# Altium schematic sheet MCU_144_IOs_Clone.SchDoc: MCU 144 I/Os
size A3; Date: Not used; ApprovedBy: Not used; CheckedBy: Not used; Author: Not used; CompanyName: STMicroelectronics; DrawnBy: Not used; Engineer: Not used; Organization: Not used; Address1: Not used; Address2: Not used; Address3: Not used; Address4: Not used; DocumentNumber: 3; Revision: Not used; SheetNumber: 3; SheetTotal: 9; CurrentTime: Not used; CurrentDate: Not used; Time: Not used; DocumentFullPathAndName: Not used; DocumentName: Not used; ModifiedDate: Not used; ImagePath: Not used; ProjectName: Not used; Application_BuildNumber: Not used
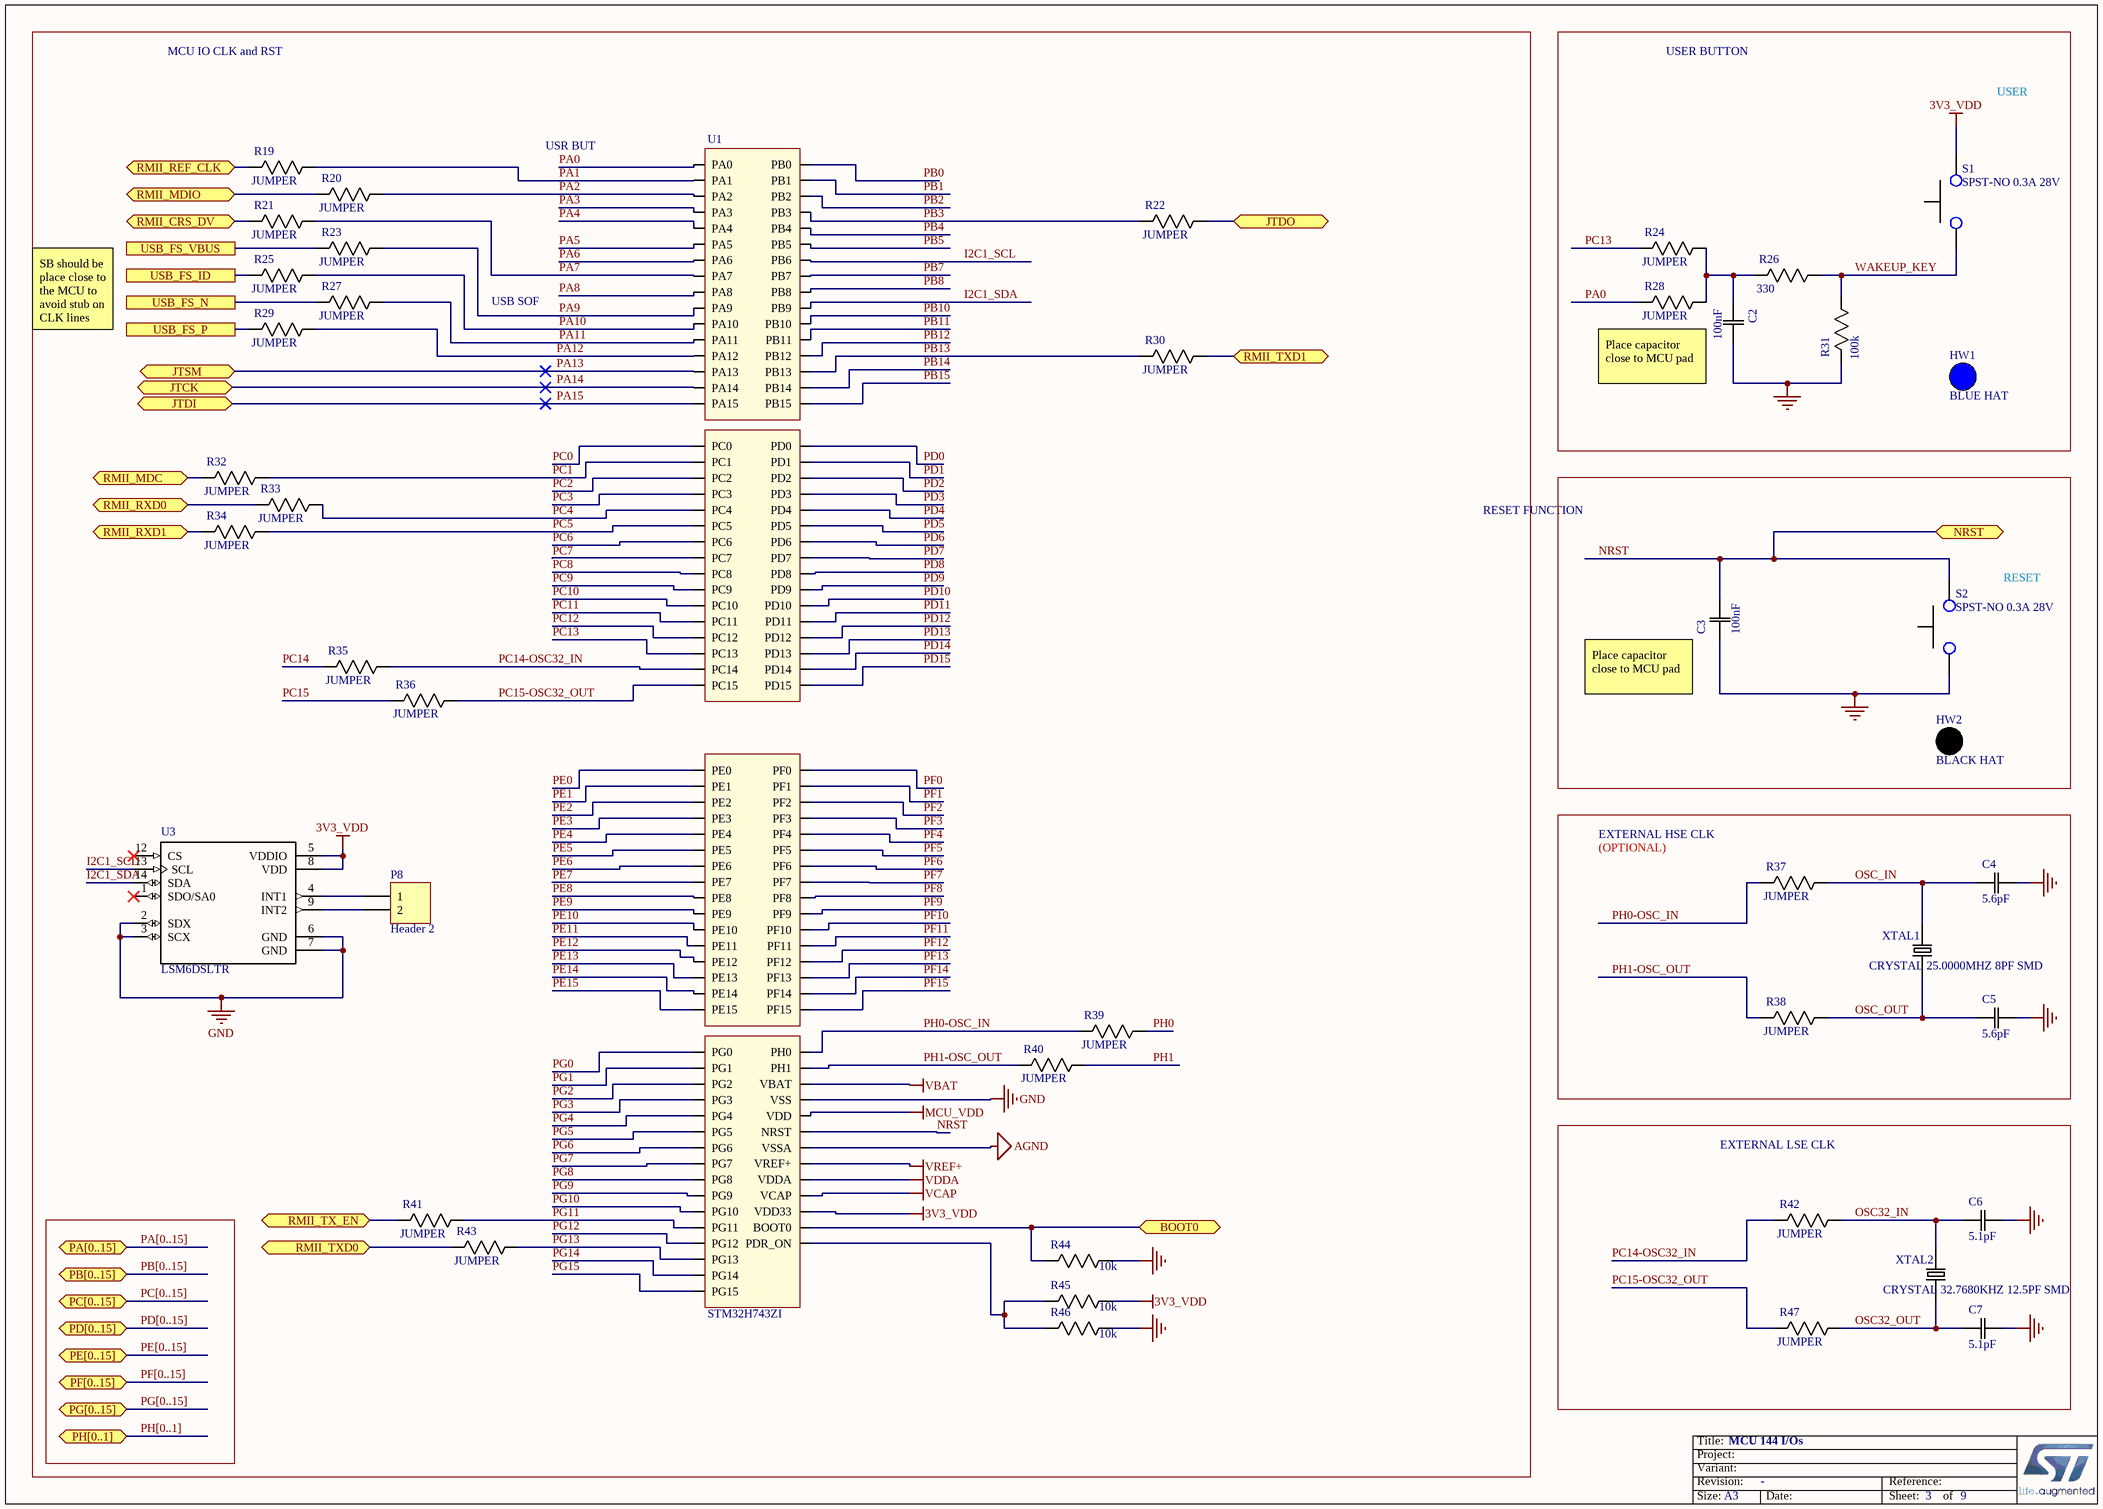
[diagram p0: MCU_144_IOs_Clone.SchDoc]

## Parts
C2  100nF  [0805]
C3  100nF  [0805]
C4  5.6pF  [0805]
C5  5.6pF  [0805]
C6  5.1pF  [0805]
C7  5.1pF  [0805]
HW1  value BLUE HAT  (hidden comment: BUTTON_HAT_BLUE)  (mechanical)
HW2  value BLACK HAT  (hidden comment: BUTTON_HAT_BLACK)  (mechanical)
P8  Header 2  [HDR1X2]
R19  JUMPER  [0805]
R20  JUMPER  [0805]
R21  JUMPER  [0805]
R22  JUMPER  [0805]
R23  JUMPER  [0805]
R24  JUMPER  [0805]
R25  JUMPER  [0805]
R26  330  [0805]
R27  JUMPER  [0805]
R28  JUMPER  [0805]
R29  JUMPER  [0805]
R30  JUMPER  [0805]
R31  100k  [0805]
R32  JUMPER  [0805]
R33  JUMPER  [0805]
R34  JUMPER  [0805]
R35  JUMPER  [0805]
R36  JUMPER  [0805]
R37  JUMPER  [0805]
R38  JUMPER  [0805]
R39  JUMPER  [0805]
R40  JUMPER  [0805]
R41  JUMPER  [0805]
R42  JUMPER  [0805]
R43  JUMPER  [0805]
R44  10k  [0805]
R45  10k  [0805]
R46  10k  [0805]
R47  JUMPER  [0805]
S1  SPST-NO 0.3A 28V  [PB300STQ]
S2  SPST-NO 0.3A 28V  [PB300STQ]
U1  STM32H743ZI  [STM32H7]
U3  LSM6DSLTR  [LGA-14]
XTAL1  CRYSTAL 25.0000MHZ 8PF SMD  [SMD-2]
XTAL2  CRYSTAL 32.7680KHZ 12.5PF SMD  [SMD-2]

## Blocks framed on the sheet
EXTERNAL LSE CLK: C6 C7 R42 R47 XTAL2

## Ports
BOOT0 (bidir), JTCK (bidir), JTDI (bidir), JTDO (bidir), JTSM (bidir), NRST (bidir), PA[0..15] (bidir), PB[0..15] (bidir), PC[0..15] (bidir), PD[0..15] (bidir), PE[0..15] (bidir), PF[0..15] (bidir), PG[0..15] (bidir), PH[0..1] (bidir), RMII_CRS_DV (bidir), RMII_MDC (bidir), RMII_MDIO (bidir), RMII_REF_CLK (bidir), RMII_RXD0 (bidir), RMII_RXD1 (bidir), RMII_TX_EN (bidir), RMII_TXD0 (bidir), RMII_TXD1 (bidir), USB_FS_ID, USB_FS_N, USB_FS_P, USB_FS_VBUS

## Nets
3V3_VDD: R45.1(R1) S1.2 U1.VDD33USB(VDD33) U3.5(VDDIO) U3.8(VDD)
AGND: U1.VSSA
GND: C2.2(C2) C3.1(C1) C4.2(C2) C5.2(C2) C6.2(C2) C7.2(C2) R31.2(R2) R44.1(R1) R46.1(R1) S2.1 U1.VSS U3.2(SDX) U3.3(SCX) U3.6(GND) U3.7(GND)
MCU_VDD: U1.VDD
VBAT: U1.VBAT
VCAP: U1.VCAP
VDDA: U1.VDDA
VREF+: U1.VREF+
BOOT0: R44.2(R2) U1.BOOT0 ; port BOOT0
I2C1_SCL: U1.PB6 U3.13(SCL)
I2C1_SDA: U1.PB9 U3.14(SDA)
JTDO: R22.1(R1) ; port JTDO
NRST: C3.2(C2) S2.2 U1.NRST ; port NRST
OSC32_IN: C6.1(C1) R42.1(R1) XTAL2.2
OSC32_OUT: C7.1(C1) R47.1(R1) XTAL2.1
OSC_IN: C4.1(C1) R37.1(R1) XTAL1.2
OSC_OUT: C5.1(C1) R38.1(R1) XTAL1.1
PA0: R28.2(R2) U1.PA0
PA1: R19.1(R1) U1.PA1
PA2: R20.1(R1) U1.PA2
PA3: U1.PA3
PA4: U1.PA4
PA5: U1.PA5
PA6: U1.PA6
PA7: R21.1(R1) U1.PA7
PA8: U1.PA8
PA9: R23.1(R1) U1.PA9
PA10: R25.1(R1) U1.PA10
PA11: R27.1(R1) U1.PA11
PA12: R29.1(R1) U1.PA12
PA13: U1.PA13 ; port JTSM
PA14: U1.PA14 ; port JTCK
PA15: U1.PA15 ; port JTDI
PB0: U1.PB0
PB1: U1.PB1
PB2: U1.PB2
PB3: R22.2(R2) U1.PB3
PB4: U1.PB4
PB5: U1.PB5
PB7: U1.PB7
PB8: U1.PB8
PB10: U1.PB10
PB11: U1.PB11
PB12: U1.PB12
PB13: R30.2(R2) U1.PB13
PB14: U1.PB14
PB15: U1.PB15
PC0: U1.PC0
PC1: R32.1(R1) U1.PC1
PC2: U1.PC2
PC3: U1.PC3
PC4: R33.1(R1) U1.PC4
PC5: R34.1(R1) U1.PC5
PC6: U1.PC6
PC7: U1.PC7
PC8: U1.PC8
PC9: U1.PC9
PC10: U1.PC10
PC11: U1.PC11
PC12: U1.PC12
PC13: R24.2(R2) U1.PC13
PC14: R35.2(R2)
PC14-OSC32_IN: R35.1(R1) R42.2(R2) U1.PC14
PC15: R36.2(R2)
PC15-OSC32_OUT: R36.1(R1) R47.2(R2) U1.PC15
PD0: U1.PD0
PD1: U1.PD1
PD2: U1.PD2
PD3: U1.PD3
PD4: U1.PD4
PD5: U1.PD5
PD6: U1.PD6
PD7: U1.PD7
PD8: U1.PD8
PD9: U1.PD9
PD10: U1.PD10
PD11: U1.PD11
PD12: U1.PD12
PD13: U1.PD13
PD14: U1.PD14
PD15: U1.PD15
PE0: U1.PE0
PE1: U1.PE1
PE2: U1.PE2
PE3: U1.PE3
PE4: U1.PE4
PE5: U1.PE5
PE6: U1.PE6
PE7: U1.PE7
PE8: U1.PE8
PE9: U1.PE9
PE10: U1.PE10
PE11: U1.PE11
PE12: U1.PE12
PE13: U1.PE13
PE14: U1.PE14
PE15: U1.PE15
PF0: U1.PF0
PF1: U1.PF1
PF2: U1.PF2
PF3: U1.PF3
PF4: U1.PF4
PF5: U1.PF5
PF6: U1.PF6
PF7: U1.PF7
PF8: U1.PF8
PF9: U1.PF9
PF10: U1.PF10
PF11: U1.PF11
PF12: U1.PF12
PF13: U1.PF13
PF14: U1.PF14
PF15: U1.PF15
PG0: U1.PG0
PG1: U1.PG1
PG2: U1.PG2
PG3: U1.PG3
PG4: U1.PG4
PG5: U1.PG5
PG6: U1.PG6
PG7: U1.PG7
PG8: U1.PG8
PG9: U1.PG9
PG10: U1.PG10
PG11: R41.1(R1) U1.PG11
PG12: U1.PG12
PG13: R43.1(R1) U1.PG13
PG14: U1.PG14
PG15: U1.PG15
PH0: R39.1(R1)
PH0-OSC_IN: R37.2(R2) R39.2(R2) U1.PH0
PH1: R40.1(R1)
PH1-OSC_OUT: R38.2(R2) R40.2(R2) U1.PH1
RMII_CRS_DV: R21.2(R2) ; port RMII_CRS_DV
RMII_MDC: R32.2(R2) ; port RMII_MDC
RMII_MDIO: R20.2(R2) ; port RMII_MDIO
RMII_REF_CLK: R19.2(R2) ; port RMII_REF_CLK
RMII_RXD0: R33.2(R2) ; port RMII_RXD0
RMII_RXD1: R34.2(R2) ; port RMII_RXD1
RMII_TX_EN: R41.2(R2) ; port RMII_TX_EN
RMII_TXD0: R43.2(R2) ; port RMII_TXD0
RMII_TXD1: R30.1(R1) ; port RMII_TXD1
USB_FS_ID: R25.2(R2) ; port USB_FS_ID
USB_FS_N: R27.2(R2) ; port USB_FS_N
USB_FS_P: R29.2(R2) ; port USB_FS_P
USB_FS_VBUS: R23.2(R2) ; port USB_FS_VBUS
WAKEUP_KEY: R26.1(R1) R31.1(R1) S1.1
NetC2_1: C2.1(C1) R24.1(R1) R26.2(R2) R28.1(R1)
NetP8_1: P8.1 U3.4(INT1)
NetP8_2: P8.2 U3.9(INT2)
NetR45_2: R45.2(R2) R46.2(R2) U1.PDR_ON

Not connected (* = marked no-connect by the designer): U3 1(SDO/SA0)* 12(CS)*

## Buses and harness runs
bus PA[0..15] = port PA[0..15]
bus PB[0..15] = port PB[0..15]
bus PC[0..15] = port PC[0..15]
bus PD[0..15] = port PD[0..15]
bus PE[0..15] = port PE[0..15]
bus PF[0..15] = port PF[0..15]
bus PG[0..15] = port PG[0..15]
bus PH[0..1] = port PH[0..1]

## Notes on the sheet
- MCU IO CLK and RST
- USER BUTTON
- USER
- USR BUT
- USB SOF
- SB should be place close to the MCU to avoid stub on CLK lines
- Place capacitor close to MCU pad
- RESET FUNCTION
- RESET
- (near C3) Place capacitor close to MCU pad
- EXTERNAL HSE CLK
- (OPTIONAL)
- Title:
- Project:
- Size:
- Revision:
- Variant:
- A3
- -
- Date:
- Reference:
- Sheet:
- of

## Library data of the parts
C2 C3 = CAP 100nF 0805: CAP CER 0.1UF 50V X7R 0805; MP: CC0805KRX7R9BB104; MF: Yageo; Tolerance: 10%; Package: 0805; Price: 0,119 CAD; Value: 100nF; Digikey: 311-1140-1-ND; Digikey Link: https://www.digikey.ca/products/en?keywords=311-1140-1-ND; Rating: 50V
C4 C5 = CAP 5.6pF 0805: CAP CER 5.6PF 50V C0G/NP0 0805; MP: C0805C569D5GACTU; MF: KEMET; Tolerance: 5%; Package: 0805; Price: 0,249 CAD; Value: 5.6pF; Digikey: 399-9261-1-ND; Digikey Link: https://www.digikey.ca/product-detail/en/kemet/C0805C569D5GACTU/399-9261-1-ND/3522779; Rating: 50V
C6 C7 = CAP 5.1pF 0805: CAP CER 5.1PF 630V NP0 0805; MP: C0805C519KBGAC7800; MF: KEMET; Tolerance: 10%; Rating: 50V; Package: 0805; Price: 0,493 CAD; Value: 5.1pF; Digikey: 399-16524-1-ND; Digikey Link: https://www.digikey.ca/product-detail/en/kemet/C0805C519KBGAC7800/399-16524-1-ND/7917337
HW1 = MCD-00634: Blue Hat for switch TD0341X-G01-BLU; Part_Type: Mechanical; Manufacturer_Part_Number: 988.16.09.3.00002_SH-517; Manufacturer: JIUBABA; Provided_By: SUBCO; Internal_Part_Number: MCD-00634; Status: Released; ComponentLink1Description: Datasheet; ComponentLink1URL: http://tunmcdsvn.tun.st.com/Component_Datasheet_Library/Trunk/Mechanical/Jiubaba_HAT_SH-517; ECCN_US: n/a; ECCN_EU: n/a
HW2 = MCD-00635: Black Hat for switch TD0341X-G01-BLA; Part_Type: Mechanical; Manufacturer_Part_Number: 988.16.09.3.00003_SH-517; Manufacturer: JIUBABA; Provided_By: SUBCO; Internal_Part_Number: MCD-00635; Status: Released; ComponentLink1Description: Datasheet; ComponentLink1URL: http://tunmcdsvn.tun.st.com/Component_Datasheet_Library/Trunk/Mechanical/Jiubaba_HAT_SH-517; ECCN_US: n/a; ECCN_EU: n/a
P8 = Header 2: Header, 2-Pin; LatestRevisionDate: 17-Jul-2002; LatestRevisionNote: Re-released for DXP Platform.; Publisher: Altium Limited
R19-R25 R27-R30 R32-R43 R47 = RES 0 0805: RES SMD 0 OHM JUMPER 1/8W 0805; MP: RC0805JR-070RL; MF: Yageo; Value: 0; Rating: 0.125W; Digikey: 311-0.0ARCT-ND; Price: 0.058 CAD; Package: 0805; Digikey Link: https://www.digikey.ca/products/en?keywords=311-0.0ARCT-ND
R26 = RES 330 0805: RES SMD 330 OHM 1% 1/8W 0805; MP: RC0805FR-07330RL; MF: Yageo; Rating: 0.125W; Digikey: 311-330CRCT-ND; Price: 0.061 CAD; Package: 0805; Value: 330; Digikey Link: https://www.digikey.ca/products/en?keywords=311-330CRCT-ND
R31 = RES 100k 0805: RES SMD 100K OHM 1% 1/8W 0805; MP: RC0805FR-07100KL; MF: Yageo; Rating: 0.125W; Digikey: 311-100KCRCT-ND; Price: 0.058 CAD; Package: 0805; Value: 100k; Digikey Link: https://www.digikey.ca/products/en?keywords=311-100KCRCT-ND; Tolerance: 1%
R44-R46 = RES 10k 0805: RES SMD 10K OHM 1% 1/8W 0805; MP: RC0805FR-0710KL; MF: Yageo; Rating: 0.125W; Digikey: 311-10.0KCRCT-ND; Price: 0.061 CAD; Package: 0805; Value: 10k; Digikey Link: https://www.digikey.ca/products/en?keywords=311-10.0KCRCT-ND; Tolerance: 1%
S1 S2 = SW PUSH NO: Pushbutton Switch SPST-NO Standard Through Hole; MF: E-Switch; Rating: 28V 0.3A; ComponentLink1Description: Digikey; ComponentLink1URL: https://www.digikey.ca/product-detail/en/e-switch/PB300STQ/EG5398-ND/6126493; ComponentLink2Description: Datasheet; ComponentLink2URL: https://sten-eswitch-13110800-production.s3.amazonaws.com/system/asset/product_line/data_sheet/222/PB300.pdf; Digikey: EG5398-ND; Digikey Link: https://www.digikey.ca/product-detail/en/e-switch/PB300STQ/EG5398-ND/6126493; MP: PB300STQ; Price: 3.40000 CAD
U1 = STM32H743ZI: MF: STMicroelectronics; MP: STM32H743ZIT6; Digikey: 497-17721-ND; Digikey Link: https://www.digikey.ca/product-detail/en/stmicroelectronics/STM32H743ZIT6/497-17721-ND/7809238; Package: 144-LQFP (20x20)
U3 = LSM6DSLTR: Accelerometer, Gyroscope, Temperature, 6 Axis Sensor IÂ²C, SPI Output; MF: STMicroelectronics; SnapEDA_Link: https://www.snapeda.com/parts/LSM6DSLTR/STMicroelectronics/view-part/550517/?ref=snap; Price: None; Availability: Unavailable; MP: LSM6DSLTR; Package: LGA-14 STMicroelectronics; Value: *
XTAL1 = XTAL 25MHZ 8PF SMD: 25MHz ±50ppm Crystal 8pF 70 Ohms 2-SMD, No Lead; MP: NX5032GA-25.000000MHZ-LN-CD-1; MF: NDK America, Inc.; ESR: 70 Ohms; Package: 2-SMD, No Lead; Price: 0.95 CAD; Frequency: 25MHz; Digikey: 644-1041-1-ND; Digikey Link: https://www.digikey.ca/product-detail/en/ndk-america-inc/NX5032GA-25.000000MHZ-LN-CD-1/644-1041-1-ND/1128913; Load Capacitance: 8pF
XTAL2 = XTAL 32.7680KHZ 12.5PF SMD: 32.768kHz ±20ppm Crystal 12.5pF 70 kOhms 2-SMD, No Lead; MP: NX3215SA-32.768K-STD-MUA-8; MF: NDK America, Inc.; Package: 2-SMD, No Lead; Price: 1.04000 CAD; Frequency: 32.768kHz; Digikey: 644-1156-1-ND; Digikey Link: https://www.digikey.ca/en/products/detail/ndk-america-inc/NX3215SA-32-768K-STD-MUA-8/2261469?s=N4IgTCBcDaIGwBYEFoCMqCsc3IHIBEQBdAXyA; Load Capacitance: 12.5pF; ESR: 70 kOhms; ComponentLink1Description: Digikey; ComponentLink1URL: https://www.digikey.ca/en/products/detail/ndk-america-inc/NX3215SA-32-768K-STD-MUA-8/2261469; ComponentLink2Description: Datasheet; ComponentLink2URL: https://media.digikey.com/datasheets/production/702868/1/NX3215SA-32-768K-STD-MUA-8.html